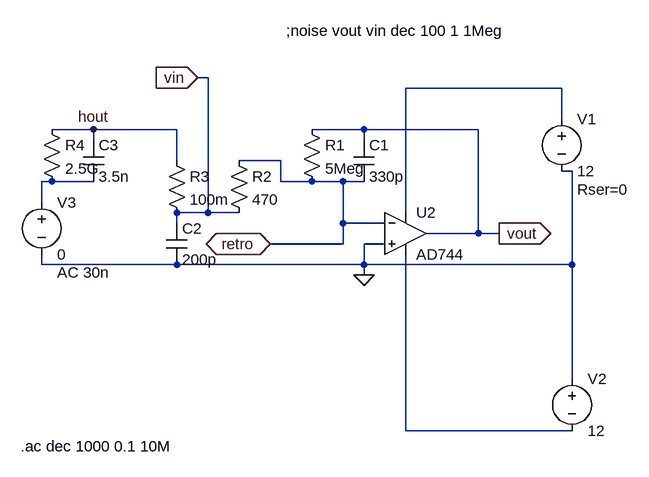
[diagram p0: schematic LTSpice.asc]
LTSpice.asc, the LTspice schematic file:
Version 4
SHEET 1 880 680
WIRE -80 -64 -96 -64
WIRE 464 -48 224 -48
WIRE 464 0 464 -48
WIRE -256 16 -320 16
WIRE -128 16 -256 16
WIRE 160 16 80 16
WIRE 336 16 160 16
WIRE -256 32 -256 16
WIRE 160 32 160 16
WIRE -128 64 -128 16
WIRE 32 64 -32 64
WIRE 480 80 464 80
WIRE -320 96 -336 96
WIRE -256 96 -320 96
WIRE 32 96 32 64
WIRE 80 96 32 96
WIRE 128 96 80 96
WIRE 160 96 128 96
WIRE -336 128 -336 96
WIRE -80 144 -80 -64
WIRE -80 144 -128 144
WIRE -32 144 -80 144
WIRE 224 144 224 -48
WIRE -128 160 -128 144
WIRE 128 160 128 96
WIRE 192 160 128 160
WIRE 336 176 336 16
WIRE 336 176 256 176
WIRE 368 176 336 176
WIRE 128 192 128 160
WIRE 128 192 16 192
WIRE 192 192 160 192
WIRE -336 224 -336 208
WIRE -128 224 -336 224
WIRE 160 224 160 192
WIRE 160 224 -128 224
WIRE 480 224 480 80
WIRE 480 224 160 224
WIRE 160 240 160 224
WIRE 480 400 480 224
WIRE 224 480 224 208
WIRE 480 480 224 480
FLAG 160 240 0
FLAG 368 176 vout
IOPIN 368 176 Out
FLAG -96 -64 vin
IOPIN -96 -64 In
FLAG 16 192 retro
IOPIN 16 192 BiDir
FLAG -256 16 hout
SYMBOL cap 144 32 R0
SYMATTR InstName C1
SYMATTR Value 330p
SYMBOL res 64 0 R0
SYMATTR InstName R1
SYMATTR Value 5Meg
SYMBOL res -48 48 R0
SYMATTR InstName R2
SYMATTR Value 470
SYMBOL cap -144 160 R0
SYMATTR InstName C2
SYMATTR Value 200p
SYMBOL res -144 48 R0
SYMATTR InstName R3
SYMATTR Value 100m
SYMBOL voltage 464 -16 R0
WINDOW 123 0 0 Left 0
WINDOW 39 24 124 Left 2
SYMATTR SpiceLine Rser=0
SYMATTR InstName V1
SYMATTR Value 12
SYMBOL voltage 480 384 R0
WINDOW 123 0 0 Left 0
WINDOW 39 0 0 Left 0
SYMATTR InstName V2
SYMATTR Value 12
SYMBOL Opamps\\AD744 224 112 R0
SYMATTR InstName U2
SYMBOL res -336 0 R0
SYMATTR InstName R4
SYMATTR Value 2.5G
SYMBOL cap -272 32 R0
SYMATTR InstName C3
SYMATTR Value 3.5n
SYMBOL voltage -336 112 R0
WINDOW 123 24 124 Left 2
WINDOW 39 0 0 Left 0
SYMATTR InstName V3
SYMATTR Value 0
SYMATTR Value2 AC 30n
TEXT -368 504 Left 2 !.ac dec 1000 0.1 10M
TEXT 40 -136 Left 2 !;noise vout vin dec 100 1 1Meg

The netlist it stands for:
* LTSpice.asc
C1 vout retro 330p
R1 vout retro 5Meg
R2 retro vin 470
C2 vin 0 200p
R3 hout vin 100m
V1 N001 0 12 Rser=0
V2 0 N003 12
XU2 0 retro N001 N003 vout AD744  ; pins In+ In- V+ V- OUT
R4 hout N002 2.5G
C3 hout N002 3.5n
V3 N002 0 0 AC 30n
.ac dec 1000 0.1 10M
;noise vout vin dec 100 1 1Meg
.backanno
.end